# Altium schematic sheet keypad.SchDoc
size A4; Engineer: Amir Hossein Jobeiri; Organization: Simaran; SheetNumber: 10; SheetTotal: 23
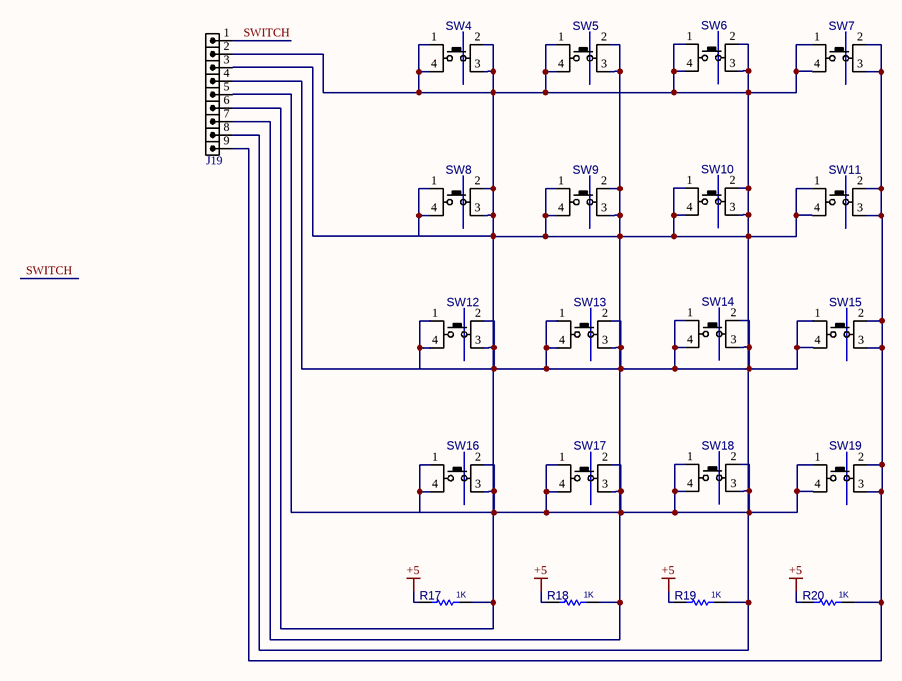
[diagram p0: keypad.SchDoc]

## Parts
J19  HDR1X9  [HDRMINI_M_1X9]  (value not drawn)
R17  1K  [R025W_AX04]
R18  1K  [R025W_AX04]
R19  1K  [R025W_AX04]
R20  1K  [R025W_AX04]
SW4  PUSHBUTTON  [SWPBT_SPDT_6X6X5]  (value not drawn)
SW5  PUSHBUTTON  [SWPBT_SPDT_6X6X5]  (value not drawn)
SW6  PUSHBUTTON  [SWPBT_SPDT_6X6X5]  (value not drawn)
SW7  PUSHBUTTON  [SWPBT_SPDT_6X6X5]  (value not drawn)
SW8  PUSHBUTTON  [SWPBT_SPDT_6X6X5]  (value not drawn)
SW9  PUSHBUTTON  [SWPBT_SPDT_6X6X5]  (value not drawn)
SW10  PUSHBUTTON  [SWPBT_SPDT_6X6X5]  (value not drawn)
SW11  PUSHBUTTON  [SWPBT_SPDT_6X6X5]  (value not drawn)
SW12  PUSHBUTTON  [SWPBT_SPDT_6X6X5]  (value not drawn)
SW13  PUSHBUTTON  [SWPBT_SPDT_6X6X5]  (value not drawn)
SW14  PUSHBUTTON  [SWPBT_SPDT_6X6X5]  (value not drawn)
SW15  PUSHBUTTON  [SWPBT_SPDT_6X6X5]  (value not drawn)
SW16  PUSHBUTTON  [SWPBT_SPDT_6X6X5]  (value not drawn)
SW17  PUSHBUTTON  [SWPBT_SPDT_6X6X5]  (value not drawn)
SW18  PUSHBUTTON  [SWPBT_SPDT_6X6X5]  (value not drawn)
SW19  PUSHBUTTON  [SWPBT_SPDT_6X6X5]  (value not drawn)

## Nets
+5: R17.2 R18.2 R19.2 R20.2
SWITCH: J19.1
NetJ19_2: J19.2 J19.3 J19.6 J19.7 J19.8 R17.1 R18.1 R19.1 SW4.1(P1) SW4.2(P3) SW4.3(P4) SW4.4(P2) SW5.1(P1) SW5.2(P3) SW5.3(P4) SW5.4(P2) SW6.1(P1) SW6.2(P3) SW6.3(P4) SW6.4(P2) SW7.1(P1) SW7.4(P2) SW8.1(P1) SW8.2(P3) SW8.3(P4) SW8.4(P2) SW9.1(P1) SW9.2(P3) SW9.3(P4) SW9.4(P2) SW10.1(P1) SW10.2(P3) SW10.3(P4) SW10.4(P2) SW11.1(P1) SW11.4(P2)
NetJ19_4: J19.4 SW12.1(P1) SW12.2(P3) SW12.3(P4) SW12.4(P2) SW13.1(P1) SW13.2(P3) SW13.3(P4) SW13.4(P2) SW14.1(P1) SW14.2(P3) SW14.3(P4) SW14.4(P2) SW15.1(P1) SW15.4(P2)
NetJ19_5: J19.5 SW16.1(P1) SW16.2(P3) SW16.3(P4) SW16.4(P2) SW17.1(P1) SW17.2(P3) SW17.3(P4) SW17.4(P2) SW18.1(P1) SW18.2(P3) SW18.3(P4) SW18.4(P2) SW19.1(P1) SW19.4(P2)
NetJ19_9: J19.9 R20.1 SW7.2(P3) SW7.3(P4) SW11.2(P3) SW11.3(P4) SW15.2(P3) SW15.3(P4) SW19.2(P3) SW19.3(P4)

## Library data of the parts
J19 = HDRMINI_M_1X9: CONN, HEADER, Male, pitch: 1.27mm, 9POS; VALUE: HDRMINI_9
R17-R20 = RES_THD: RESISTOR, THD; MANF_P#: RK73H1ETTP4701F; MANF: KOA SPEER; PARAM: 0.063W; DESC: DESCRIPTION; DIST#: MOUSER; PARAM2: 1%; ASSEMBLY: ASSEMBLY; PRICE: 100= 0.5$; VALUE: 1K
SW4-SW19 = SWPBT_SPDT_6X6X5: SWITCH, PUSH BUTTON, TACTILE, THD, SPDT, 4X4MM; DESC: DESCRIPTION; MANF: -; VALUE: PUSHBUTTON; ASSEMBLY: ASSEMBLY; PARAM: PARAM; PRICE: PRICE; MANF_P#: -